# EAGLE design Fan-Module (EAGLE 9.3.0)
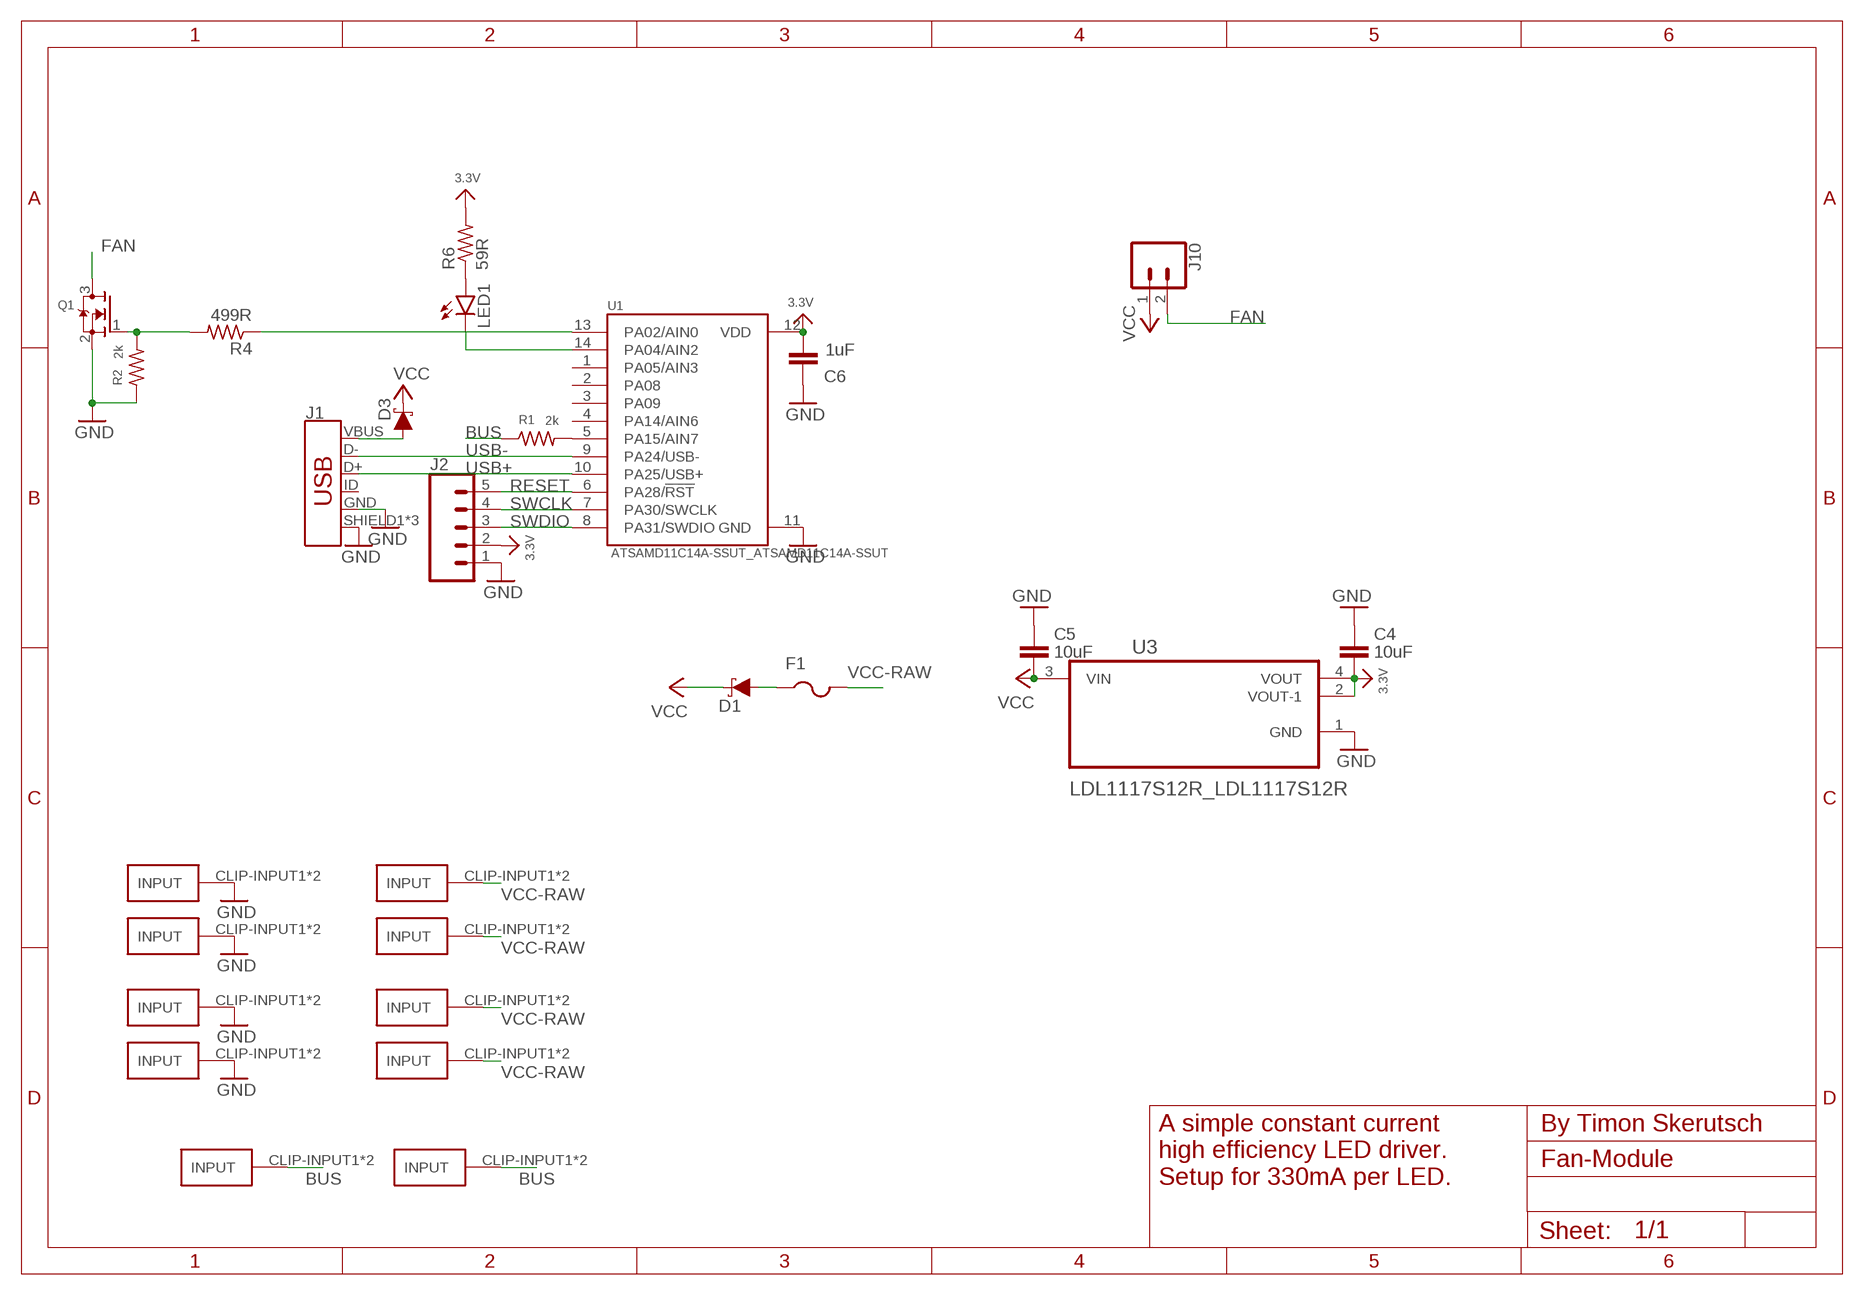
[diagram p0: schematic, sheet 1]

## Parts
C4  10uF  C-EUC0603  [C0603]
C5  10uF  C-EUC0603  [C0603]
C6  1uF  C-EUC0603  [C0603]
D1  3A/40V/500mV  DIODE-SCHOTTKY-B340A  [SMA-DIODE]
D3  3A/40V/500mV  DIODE-SCHOTTKY-B340A  [SMA-DIODE]
F1  PTCFUSE-1812  [1812]
GND-CLIP  FUSE-HOLDER-5X20MM  [FUSE-HOLDER-5X20MM]
GND-CLIP1  FUSE-HOLDER-5X20MM  [FUSE-HOLDER-5X20MM]
GND-CLIP2  FUSE-HOLDER-5X20MM  [FUSE-HOLDER-5X20MM]
GND-CLIP3  FUSE-HOLDER-5X20MM  [FUSE-HOLDER-5X20MM]
J1  USB_MICRO-B_FEMALE-SMT  [USB-B-MICRO-SMD]
J2  CONN_05  [1X05]
J10  CONN_02PTH3  [1X02_LONGPADS]
LED1  LEDCHIPLED_0805  [CHIPLED_0805]
PWM-CLIP  FUSE-HOLDER-5X20MM  [FUSE-HOLDER-5X20MM]
PWM-CLIP1  FUSE-HOLDER-5X20MM  [FUSE-HOLDER-5X20MM]
Q1  MOSFET-NWIDE  [SOT23-WIDE]
R1  2k  R-US_R1206  [R1206]
R2  2k  R-US_R1206  [R1206]
R4  499R  R-US_R0805  [R0805]
R6  59R  R-US_R0805  [R0805]
U1  ATSAMD11C14A-SSUT_ATSAMD11C14A-SSUT  [ATSAMD11C14A-SSUT_SOIC127P600X160-14N]
U3  LDL1117S12R_LDL1117S12R  [LDL1117S12R_SOT230P700X180-4N]
VCC-CLIP  FUSE-HOLDER-5X20MM  [FUSE-HOLDER-5X20MM]
VCC-CLIP1  FUSE-HOLDER-5X20MM  [FUSE-HOLDER-5X20MM]
VCC-CLIP2  FUSE-HOLDER-5X20MM  [FUSE-HOLDER-5X20MM]
VCC-CLIP3  FUSE-HOLDER-5X20MM  [FUSE-HOLDER-5X20MM]

## Nets
3.3V: C4.2 C6.2 J2.2 R6.2 U1.12(VDD) U3.2(VOUT-1) U3.4(VOUT)
BUS: PWM-CLIP1.CLIP-INPUT1(INPUT) PWM-CLIP1.CLIP-INPUT2(INPUT) PWM-CLIP.CLIP-INPUT1(INPUT) PWM-CLIP.CLIP-INPUT2(INPUT) R1.1
FAN: J10.2 Q1.3(D)
GND: C4.1 C5.1 C6.1 GND-CLIP1.CLIP-INPUT1(INPUT) GND-CLIP1.CLIP-INPUT2(INPUT) GND-CLIP2.CLIP-INPUT1(INPUT) GND-CLIP2.CLIP-INPUT2(INPUT) GND-CLIP3.CLIP-INPUT1(INPUT) GND-CLIP3.CLIP-INPUT2(INPUT) GND-CLIP.CLIP-INPUT1(INPUT) GND-CLIP.CLIP-INPUT2(INPUT) J1.GND J1.SHIELD1(SHIELD) J1.SHIELD2(SHIELD) J1.SHIELD3(SHIELD) J2.1 Q1.2(S) R2.1 U1.11(GND) U3.1(GND)
N$1: LED1.C U1.14(PA04/AIN2)
N$2: LED1.A R6.1
N$3: R1.2 U1.5(PA15/AIN7)
N$4: D3.A J1.VBUS
N$5: R4.1 U1.13(PA02/AIN0)
N$6: D1.A F1.1
N$8: Q1.1(G) R2.2 R4.2
RESET: J2.5 U1.6(PA28/!RST)
SWCLK: J2.4 U1.7(PA30/SWCLK)
SWDIO: J2.3 U1.8(PA31/SWDIO)
USB+: J1.D+ U1.10(PA25/USB+)
USB-: J1.D- U1.9(PA24/USB-)
VCC: C5.2 D1.C D3.C J10.1 U3.3(VIN)
VCC-RAW [VCC]: F1.2 VCC-CLIP1.CLIP-INPUT1(INPUT) VCC-CLIP1.CLIP-INPUT2(INPUT) VCC-CLIP2.CLIP-INPUT1(INPUT) VCC-CLIP2.CLIP-INPUT2(INPUT) VCC-CLIP3.CLIP-INPUT1(INPUT) VCC-CLIP3.CLIP-INPUT2(INPUT) VCC-CLIP.CLIP-INPUT1(INPUT) VCC-CLIP.CLIP-INPUT2(INPUT)
Unconnected: J1.ID U1.1(PA05/AIN3) U1.2(PA08) U1.3(PA09) U1.4(PA14/AIN6)

## Notes on the sheet
- By Timon Skerutsch
- A simple constant current
  high efficiency LED driver.
  Setup for 330mA per LED.

## Library data of the parts
C4-C6 = rcl:C-EU: CAPACITOR, European symbol; SPICEPREFIX: C
D1 D3 = SparkFun-DiscreteSemi:DIODE-SCHOTTKY: Schottky diode A Schottky diode is a semiconductor diode which has a low forward voltage drop and a very fast switching action.; PROD_ID: DIO-09886
F1 = adafruit:PTCFUSE: PTC fuses, resettable thermistors
GND-CLIP GND-CLIP1-GND-CLIP3 PWM-CLIP PWM-CLIP1 VCC-CLIP VCC-CLIP1-VCC-CLIP3 = timon-diverses:FUSE-HOLDER-5X20MM
J1 = SparkFun-Connectors:USB_MICRO-B: USB Type Micro-B Connector Male/female and PTH/SMT variants SparkFun Products: SparkFun microB USB Breakout <https://www.sparkfun.com/products/12035> SparkFun USB microB Plug Breakout <https://www.sparkfun.com/products/10031> SparkFun ESP8266 Thing <https://www.sparkfun.com/products/13231>; PROD_ID: CONN-11752
J2 = SparkFun-Connectors:CONN_05: Multi connection point. Often used as Generic Header-pin footprint for 0.1 inch spaced/style header connections On any of the 0.1 inch spaced packages, you can populate with these: Break Away Headers - Straight <https://www.sparkfun.com/products/116> (PRT-00116) Break Away Male Headers - Right Angle <https://www.sparkfun.com/products/553> (PRT-00553) Female Headers <https://www.sparkfun.com/products/115> (PRT-00115) Break Away Headers - Machine Pin <https://www.sparkfun.com/products/117> (PRT-00117) Break Away Female Headers - Swiss Machine Pin <https://www.sparkfun.com/products/743> (PRT-00743) For SCREWTERMINALS and SPRING TERMINALS visit here: Screw Terimnals on SparkFun.com <https://www.sparkfun.com/search/results?term=Screw+Terminals> (5mm/3.5mm/2.54mm spacing) This device is also useful as a general connection point to wire up your design to another part of your project. Our various solder wires solder well into these plated through hole pads. Hook-Up Wire - Assortment (Stranded, 22 AWG) <https://www.sparkfun.com/products/11375> (PRT-11375) Hook-Up Wire - Assortment (Solid Core, 22 AWG) <https://www.sparkfun.com/products/11367> (PRT-11367) View the entire wire category on our website here <https://www.sparkfun.com/categories/141> Special notes: Molex polarized connector foot print use with SKU : PRT-08231 with associated crimp pins and housings. 1MM SMD Version SKU: PRT-10208
J10 = SparkFun-Connectors:CONN_02: Multi connection point. Often used as Generic Header-pin footprint for 0.1 inch spaced/style header connections On any of the 0.1 inch spaced packages, you can populate with these: Break Away Headers - Straight <https://www.sparkfun.com/products/116> (PRT-00116) Break Away Male Headers - Right Angle <https://www.sparkfun.com/products/553> (PRT-00553) Female Headers <https://www.sparkfun.com/products/115> (PRT-00115) Break Away Headers - Machine Pin <https://www.sparkfun.com/products/117> (PRT-00117) Break Away Female Headers - Swiss Machine Pin <https://www.sparkfun.com/products/743> (PRT-00743) For SCREWTERMINALS and SPRING TERMINALS visit here: Screw Terimnals on SparkFun.com <https://www.sparkfun.com/search/results?term=Screw+Terminals> (5mm/3.5mm/2.54mm spacing) This device is also useful as a general connection point to wire up your design to another part of your project. Our various solder wires solder well into these plated through hole pads. Hook-Up Wire - Assortment (Stranded, 22 AWG) <https://www.sparkfun.com/products/11375> (PRT-11375) Hook-Up Wire - Assortment (Solid Core, 22 AWG) <https://www.sparkfun.com/products/11367> (PRT-11367) View the entire wire category on our website here <https://www.sparkfun.com/categories/141> Special notes: Molex polarized connector foot print use with: PRT-08233 with associated crimp pins and housings. 2.54_SCREWTERM for use with PRT-10571. 3.5mm Screw Terminal footprints for PRT-08084 5mm Screw Terminal footprints for use with PRT-08432
LED1 = led:LED: LED OSRAM: - CHIPLED LG R971, LG N971, LY N971, LG Q971, LY Q971, LO R971, LY R971 LH N974, LH R974 LS Q976, LO Q976, LY Q976 LO Q996 - Hyper CHIPLED LW Q18S LB Q993, LB Q99A, LB R99A - SideLED LS A670, LO A670, LY A670, LG A670, LP A670 LB A673, LV A673, LT A673, LW A673 LH A674 LY A675 LS A676, LA A676, LO A676, LY A676, LW A676 LS A679, LY A679, LG A679 - Hyper Micro SIDELED® LS Y876, LA Y876, LO Y876, LY Y876 LT Y87S - SmartLED LW L88C, LW L88S LB L89C, LB L89S, LG L890 LS L89K, LO L89K, LY L89K LS L896, LA L896, LO L896, LY L896 - TOPLED LS T670, LO T670, LY T670, LG T670, LP T670 LSG T670, LSP T670, LSY T670, LOP T670, LYG T670 LG T671, LOG T671, LSG T671 LB T673, LV T673, LT T673, LW T673 LH T674 LS T676, LA T676, LO T676, LY T676, LB T676, LH T676, LSB T676, LW T676 LB T67C, LV T67C, LT T67C, LS T67K, LO T67K, LY T67K, LW E67C LS E67B, LA E67B, LO E67B, LY E67B, LB E67C, LV E67C, LT E67C LW T67C LS T679, LY T679, LG T679 LS T770, LO T770, LY T770, LG T770, LP T770 LB T773, LV T773, LT T773, LW T773 LH T774 LS E675, LA E675, LY E675, LS T675 LS T776, LA T776, LO T776, LY T776, LB T776 LHGB T686 LT T68C, LB T68C - Hyper Mini TOPLED® LB M676 - Mini TOPLED Santana® LG M470 LS M47K, LO M47K, LY M47K Source: http://www.osram.convergy.de LUXEON: - LUMILED® LXK2-PW12-R00, LXK2-PW12-S00, LXK2-PW14-U00, LXK2-PW14-V00 LXK2-PM12-R00, LXK2-PM12-S00, LXK2-PM14-U00 LXK2-PE12-Q00, LXK2-PE12-R00, LXK2-PE12-S00, LXK2-PE14-T00, LXK2-PE14-U00 LXK2-PB12-K00, LXK2-PB12-L00, LXK2-PB12-M00, LXK2-PB14-N00, LXK2-PB14-P00, LXK2-PB14-Q00 LXK2-PR12-L00, LXK2-PR12-M00, LXK2-PR14-Q00, LXK2-PR14-R00 LXK2-PD12-Q00, LXK2-PD12-R00, LXK2-PD12-S00 LXK2-PH12-R00, LXK2-PH12-S00 LXK2-PL12-P00, LXK2-PL12-Q00, LXK2-PL12-R00 Source: www.luxeon.com KINGBRIGHT: KA-3528ASYC Source: www.kingbright.com
Q1 = microbuilder:MOSFET-N: N-Channel Mosfet LEGEND VDS: Voltage Drain-Source ID: Drain Current RDS(ON): Drain-Source On-State Resistance VGS(TH): Gate-Source Threshold Voltage CISS: Drain-Source Input Capacitance SOT-23 Name VDS ID RDS(ON) VGS(TH) CISS Order Number 2N7002E 60V 260mA 2.5 Ohm 2.5V @ 250uA 26.7pF @ 25V 2N7002ET1GOSTR-ND BSH103 30V 850mA 400 mOhm 400mV @ 1mA 83pF @ 24V BSH103,235-ND BSS138 60V 320mA 1.6 Ohm 1.5V @ 250uA 50pF @ 10V Mouser: 771-BSS138PW115 DMN2075U-7 20V 4.2A 38 mOhm 1V @ 250 uA 594.3pF @ 10V DMN2075U-7DICT-ND * BSS138 good choice for I2C level-shifting
R1 R2 R4 R6 = rcl:R-US_: RESISTOR, American symbol; SPICEPREFIX: R
U1 = LED-Board:ATSAMD11C14A-SSUT_ATSAMD11C14A-SSUT: MCU 32-Bit SAM D11 ARM Cortex M0+ RISC 16KB Flash 1.8V/2.5V/3.3V 14-Pin SOIC T/R; AVAILABILITY: Good; DESCRIPTION: Cortex-M0+, 16KB FLASH, 4KB SRAM, USB - 14 SOIC, INDUSTRIAL, GREEN, 1.6-3.6V, 48MHz/ SOIC .150 (SS); MF: Microchip; MP: ATSAMD11C14A-SSUT; PACKAGE: SOIC-14 Microchip; PRICE: 1.18 USD
U3 = LDL1117S12R:LDL1117S12R_LDL1117S12R: None; AVAILABILITY: Good; DESCRIPTION: 1.2 A High PSRR low dropout linear voltage regulator; MF: STMicroelectronics; MP: LDL1117S12R; PACKAGE: SOT-223 STMicroelectronics; PRICE: 0.22 USD

## Net classes
1 VCC: clearance 0.508 mm

## Board
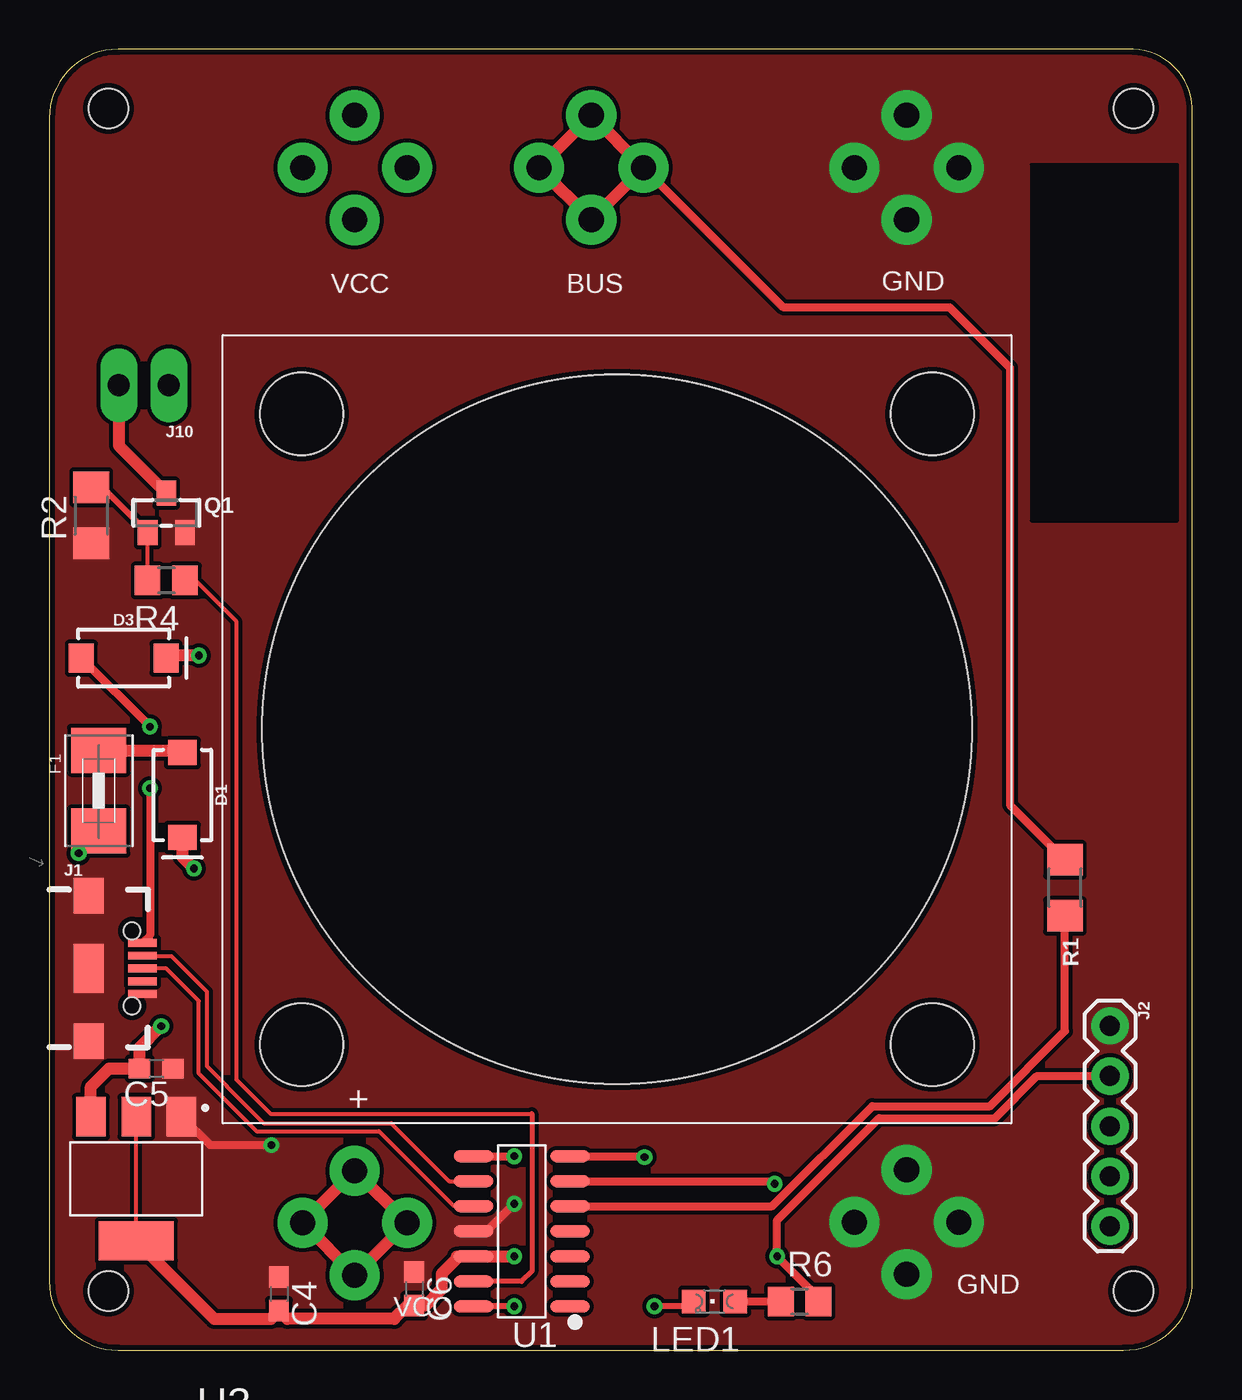
[diagram p1: board, top side]
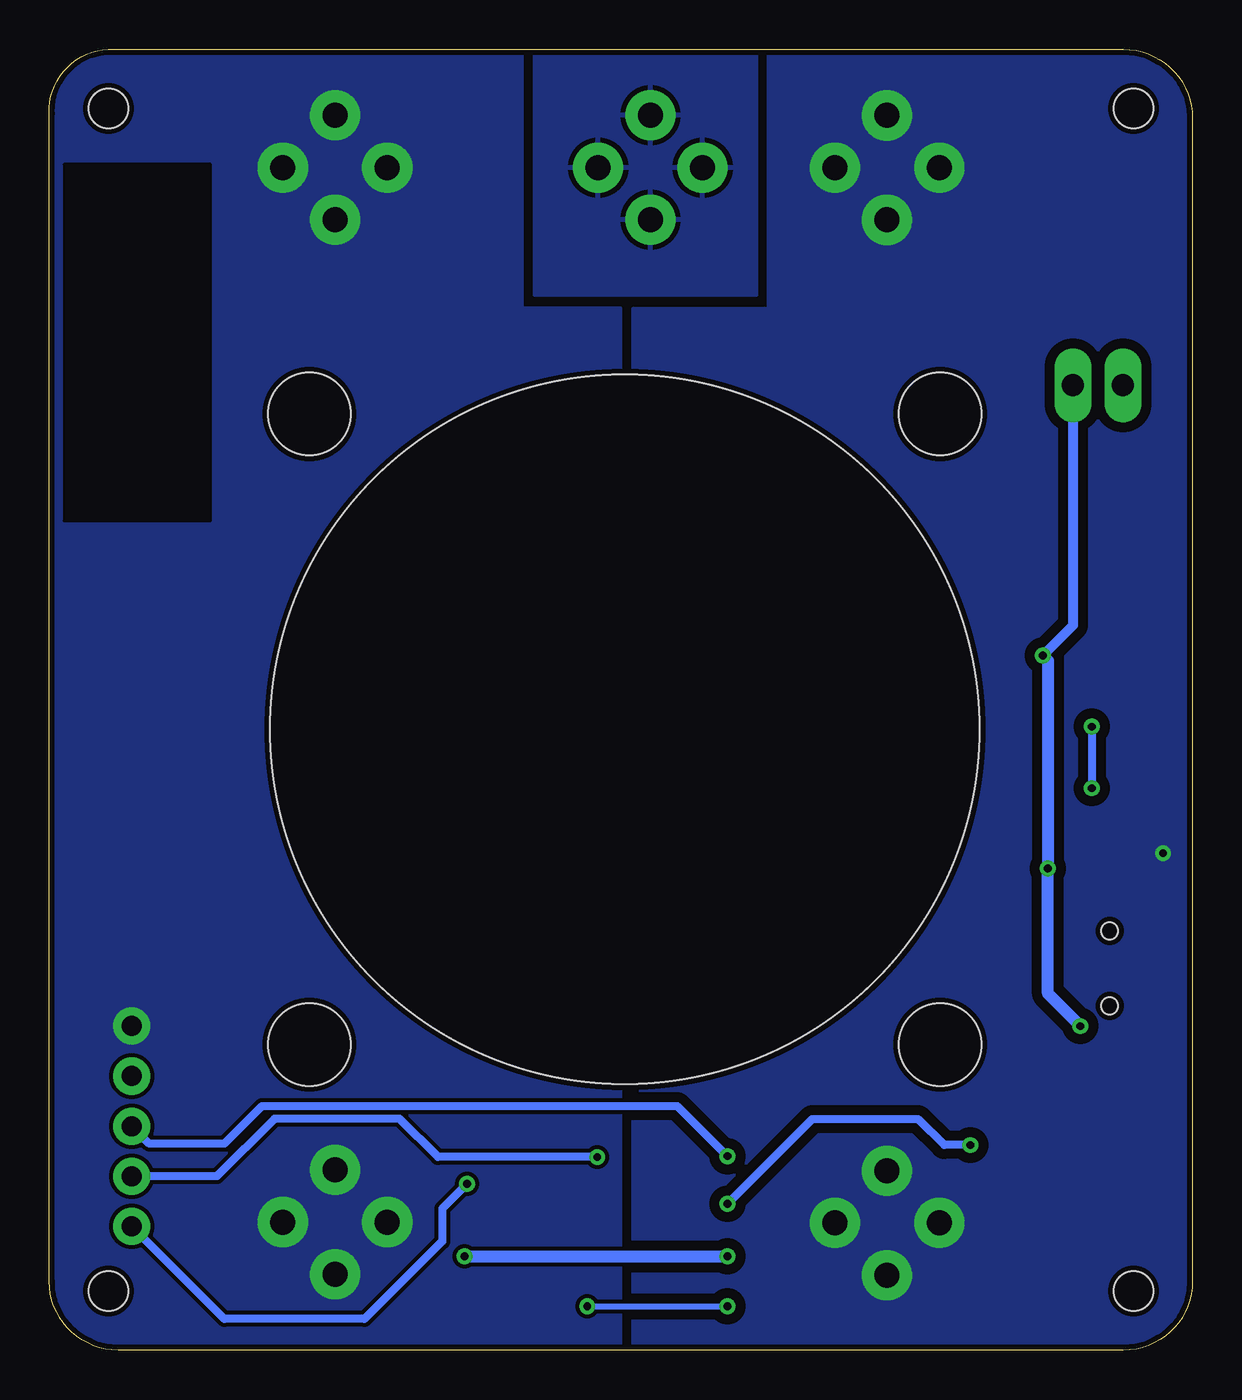
[diagram p2: board, bottom side, seen from below]

Size 58 x 66 mm. Coordinates in mm from the lower left corner, seen from the top.
Outline: 54.5,0 arc90 58,3.5 58,62.75 arc90 55.01,66 3.5,66 arc90 0,62.5 0,3.5 arc90 3.5,0 54.5,0
Copper layers (1*16): Top 0.035mm / dielectric 1.5mm / Bottom 0.035mm
Design rules "led_module *": minimum track width 8mil, minimum drill 15.5mil, track to track 8mil, track to pad 8mil, pad to pad 8mil, via to via 8mil, smd to smd 0mil, copper to edge 11mil, drill to drill 8mil, minimum pad ring 10mil, minimum via ring 8mil, stop-mask expansion 0.116840625mm, vias tented up to drill 20mil, thermal gap 10mil
Holes 2 mm at 3,63 55,63 3,3 55,3
tRestrict: area 49.8,42.1 to 57.2,60.2
bRestrict: area 49.8,42.1 to 57.2,60.2

### Footprints (pad centres in the part's own frame; a part is rotated, then mirrored left to right if it is on the bottom)
C0603 = smd 1.1 x 1: 1 -0.85,0; 2 0.85,0
SMA-DIODE = smd 1.27 x 1.47: A -2.15,0; C 2.15,0
1812 = smd 2.286 x 2.794: 1 -2.046,0; 2 2.046,0
FUSE-HOLDER-5X20MM = drill 1.27 pad 2.54: CLIP-INPUT1 -2.65,0; CLIP-INPUT2 2.65,0
USB-B-MICRO-SMD = smd 1.45 x 0.4: D+ 2.725,0; D- 2.725,0.65; GND 2.725,-1.3; ID 2.725,-0.65; VBUS 2.725,1.3 | smd 1.5 x 1.8: SHIELD1 0,3.685; SHIELD2 0,-3.685 | smd 1.5 x 2.5: SHIELD3 0,0 | hole 0.85: 2.2,1.9; 2.2,-1.9
1X05 = drill 1.016 pad 1.88: 1 0,0; 2 2.54,0; 3 5.08,0; 4 7.62,0; 5 10.16,0
1X02_LONGPADS = drill 1.118 pad 1.88 long: 1 0,0; 2 2.54,0
CHIPLED_0805 = smd 1.2 x 1.2: A 0,-1.05; C 0,1.05
SOT23-WIDE = smd 1 x 1.27: 1 -0.95,-1; 2 0.95,-1; 3 0,1
R1206 = smd 1.6 x 1.803: 1 -1.422,0; 2 1.422,0
R0805 = smd 1.3 x 1.5: 1 -0.95,0; 2 0.95,0
ATSAMD11C14A-SSUT_SOIC127P600X160-14N = smd 2 x 0.6: 1 -2.45,3.81; 2 -2.45,2.54; 3 -2.45,1.27; 4 -2.45,0; 5 -2.45,-1.27; 6 -2.45,-2.54; 7 -2.45,-3.81; 8 2.45,-3.81; 9 2.45,-2.54; 10 2.45,-1.27; 11 2.45,0; 12 2.45,1.27; 13 2.45,2.54; 14 2.45,3.81
LDL1117S12R_SOT230P700X180-4N = smd 1.5 x 2: 1 -2.3,-3.15; 2 0,-3.15; 3 2.3,-3.15 | smd 3.8 x 2: 4 0,3.15
40MM-FAN = hole 36: 0,0 | hole 4.2: -16,16; 16,16; 16,-16; -16,-16

### Placement (x,y rotation side)
C4  11.65,2.86 270 top
C5  5.43,14.29 180 top
C6  18.51,3.11 270 top
D1  6.76,28.16 270 top
D3  3.78,35.12 0 top
F1  2.51,28.38 270 top
GND-CLIP  43.5,60 0 top
GND-CLIP1  43.5,6.5 90 top
GND-CLIP2  43.5,6.5 0 top
GND-CLIP3  43.5,60 90 top
J1  2,19.37 0 top
J2  53.82,16.45 270 top
J10  6.06,48.96 180 top
LED1  33.75,2.48 90 top
PWM-CLIP  27.5,60 0 top
PWM-CLIP1  27.5,60 90 top
Q1  5.94,42.48 0 top
R1  51.53,23.46 270 top
R2  2.13,42.35 90 top
R4  5.94,39.05 180 top
R6  38.07,2.48 0 top
U1  23.97,6.03 180 top
U3  4.41,8.7 180 top
U$1  [40MM-FAN]  28.8,31.5 0 top
VCC-CLIP  15.5,60 0 top
VCC-CLIP1  15.5,6.46 90 top
VCC-CLIP2  15.5,6.46 0 top
VCC-CLIP3  15.5,59.99 270 bottom

### Tracks (layer width: path | path; a pad name or v marks a point on that pad's centre or on a via)
3.3V  (via drill 0.39)
  Top 0.203: U3.4 U3.2
  Top 0.406: R6.2 39.02,2.67 v36.93,4.76 36.93,6.6 42.1,11.77 47.97,11.77 50.11,13.91 J2.2
  Top 0.61: U3.4 8.38,1.59 11.23,1.59 C4.2 12.07,1.59 17.5,1.59 18.17,2.26 C6.2 19.06,2.26 19.91,3.11 19.91,3.87 20.8,4.76 U1.12 | 20.67,4.76 U1.12 | U1.12 v23.59,4.76
  Bottom 0.61: v36.93,4.76 v23.59,4.76
BUS
  Top 0.406: R1.1 48.74,27.67 48.74,49.85 45.69,52.9 37.25,52.9 PWM-CLIP.CLIP-INPUT2
  Top 0.61: PWM-CLIP.CLIP-INPUT2 | PWM-CLIP.CLIP-INPUT2 PWM-CLIP1.CLIP-INPUT2 | PWM-CLIP1.CLIP-INPUT1 PWM-CLIP.CLIP-INPUT1 PWM-CLIP1.CLIP-INPUT2 | PWM-CLIP.CLIP-INPUT2 PWM-CLIP1.CLIP-INPUT1
  pour Bottom (rank 3): 22.13,66.5 22.13,53.5 33.37,53.5 33.37,66.5
FAN
  Top 0.61: J10.2 3.53,45.9 Q1.3
GND  (via drill 0.39)
  Top 0.305: 6.89,41.15 Q1.2
  Top 0.406: U3.1 8.16,10.41 v11.27,10.41 | v23.59,7.43 22.19,6.03 U1.11
  Bottom 0.406: v11.27,10.41 12.6,10.41 13.91,11.72 19.3,11.72 v23.59,7.43
  pour Top (rank 2, no thermals): -0.5,66 60.5,66 60.5,0 -0.5,0
  pour Bottom (rank 2, no thermals): 29,52.87 34,52.87 34,66.5 61.5,66.5 61.5,-1 29,-1
N$1  (via drill 0.39)
  Top 0.305: LED1.C 32.45,2.22 v30.7,2.22 | v23.59,2.22 U1.14
  Bottom 0.305: v30.7,2.22 v23.59,2.22
N$2
  Top 0.406: LED1.A R6.1
N$3
  Top 0.406: U1.5 36.67,7.3 41.75,12.38 47.72,12.38 51.53,16.19 R1.2
N$4  (via drill 0.39)
  Top 0.406: D3.A v5.11,31.64 | v5.11,28.51 5.11,21.05 J1.VBUS
  Bottom 0.406: v5.11,31.64 v5.11,28.51
N$5
  Top 0.203: 24.48,12 11.23,12 9.51,13.73 9.51,36.97 7.42,39.05 R4.1
  Top 0.254: 24.48,12 24.48,4 23.97,3.49 U1.13
N$6
  Top 0.61: D1.A 6.64,30.43 F1.1
N$8
  Top 0.203: R4.2 Q1.1
  Top 0.305: R2.2 2.69,43.78 Q1.1
RESET  (via drill 0.39)
  Top 0.406: U1.6 36.67,8.57 v36.8,8.45
  Bottom 0.406: v36.8,8.45 38.07,7.18 38.07,5.53 42.01,1.59 49.12,1.59 J2.5
SWCLK  (via drill 0.39)
  Top 0.406: U1.7 30.15,9.84 v30.2,9.8
  Bottom 0.406: v30.2,9.8 38.28,9.8 40.23,11.75 46.58,11.75 49.5,8.83 J2.4
SWDIO  (via drill 0.39)
  Top 0.406: U1.8 v23.59,9.84
  Bottom 0.406: v23.59,9.84 26.13,12.38 47.21,12.38 49.12,10.48 52.93,10.48 J2.3
USB+
  Top 0.203: U1.10 20.54,7.3 16.73,11.11 10.51,11.11 7.59,14.03 7.59,17.72 5.94,19.37 J1.D+
USB-
  Top 0.203: U1.9 20.29,8.57 17.34,11.52 10.87,11.52 9.01,13.37 9.01,13.4 7.99,14.41 7.99,18.2 6.19,20 4.74,20 J1.D-
VCC  (via drill 0.39)
  Top 0.61: D1.C 6.76,25.03 v7.34,24.45 | v7.59,35.24 6.06,35.24 D3.C | U3.3 2.11,13.37 3.03,14.29 C5.2 4.58,15.34 v5.68,16.45
  Bottom 0.508: J10.1 6.06,36.77 v7.59,35.24
  Bottom 0.61: v7.59,35.24 7.34,34.99 v7.34,24.45 7.34,18.1 v5.68,16.45
VCC-RAW  (via drill 0.39)
  Top 0.61: VCC-CLIP1.CLIP-INPUT1 | VCC-CLIP1.CLIP-INPUT1 VCC-CLIP2.CLIP-INPUT2 VCC-CLIP1.CLIP-INPUT2 VCC-CLIP2.CLIP-INPUT1 VCC-CLIP1.CLIP-INPUT1 | F1.2 2.51,26.23 v1.49,25.21
  pour Bottom (no thermals): -1.53,66.34 -1.53,-0.81 28.38,-0.81 28.38,52.88 21.52,52.88 21.52,66.34

### Text on the board
tPlace: +
tNames: VCC | BUS | GND | GND | VCC